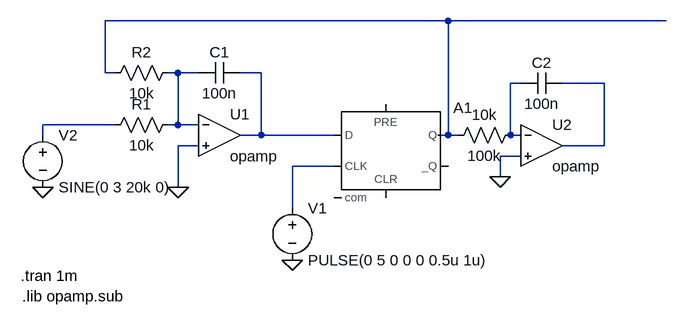
[diagram p0: schematic Draft1.asc]
Draft1.asc, the LTspice schematic file:
Version 4
SHEET 1 880 680
WIRE 288 -64 -240 -64
WIRE 624 -64 288 -64
WIRE -240 16 -240 -64
WIRE -224 16 -240 16
WIRE -128 16 -144 16
WIRE -96 16 -128 16
WIRE 0 16 -32 16
WIRE 400 32 384 32
WIRE 528 32 464 32
WIRE -224 96 -336 96
WIRE -128 96 -128 16
WIRE -128 96 -144 96
WIRE -96 96 -128 96
WIRE -336 112 -336 96
WIRE 0 112 0 16
WIRE 0 112 -32 112
WIRE 112 112 0 112
WIRE 288 112 288 -64
WIRE 288 112 272 112
WIRE 304 112 288 112
WIRE 384 112 384 32
WIRE 400 112 384 112
WIRE -96 128 -128 128
WIRE 528 128 528 32
WIRE 528 128 464 128
WIRE 400 144 368 144
WIRE 112 160 48 160
WIRE 368 176 368 144
WIRE -128 192 -128 128
WIRE 48 224 48 160
FLAG -128 192 0
FLAG 368 176 0
FLAG 48 304 0
FLAG -336 192 0
SYMBOL res -128 80 R90
WINDOW 0 0 56 VBottom 2
WINDOW 3 32 56 VTop 2
SYMATTR InstName R1
SYMATTR Value 10k
SYMBOL res -128 0 R90
WINDOW 0 0 56 VBottom 2
WINDOW 3 32 56 VTop 2
SYMATTR InstName R2
SYMATTR Value 10k
SYMBOL cap -32 0 R90
WINDOW 0 0 32 VBottom 2
WINDOW 3 32 32 VTop 2
SYMATTR InstName C1
SYMATTR Value 100n
SYMBOL res 400 96 R90
WINDOW 0 0 56 VBottom 2
WINDOW 3 32 56 VTop 2
SYMATTR InstName 10k
SYMATTR Value 100k
SYMBOL cap 464 16 R90
WINDOW 0 0 32 VBottom 2
WINDOW 3 32 32 VTop 2
SYMATTR InstName C2
SYMATTR Value 100n
SYMBOL voltage -336 96 R0
WINDOW 123 0 0 Left 0
WINDOW 39 0 0 Left 0
SYMATTR InstName V2
SYMATTR Value SINE(0 3 20k 0)
SYMBOL voltage 48 208 R0
WINDOW 123 0 0 Left 0
WINDOW 39 0 0 Left 0
SYMATTR InstName V1
SYMATTR Value PULSE(0 5 0 0 0 0.5u 1u)
SYMBOL Digital\\dflop 192 64 R0
SYMATTR InstName A1
SYMBOL OpAmps\\opamp -64 48 R0
SYMATTR InstName U1
SYMBOL OpAmps\\opamp 432 64 R0
SYMATTR InstName U2
TEXT -370 328 Left 2 !.tran 1m
TEXT -368 360 Left 2 !.lib opamp.sub

The netlist it stands for:
* Draft1.asc
R1 N002 N006 10k
R2 N002 N001 10k
C1 N003 N002 100n
R§10k N004 N001 100k
C2 N005 N004 100n
V2 N006 0 SINE(0 3 20k 0)
V1 N007 0 PULSE(0 5 0 0 0 0.5u 1u)
A1 N003 0 N007 0 0 0 N001 0 DFLOP
XU1 N002 0 N003 opamp Aol=100K GBW=10Meg  ; pins invin noninvin out
XU2 N004 0 N005 opamp Aol=100K GBW=10Meg  ; pins invin noninvin out
.tran 1m
.lib opamp.sub
.backanno
.end